# Altium schematic sheet 07_Ethernet_Interface.SchDoc
size A4; SheetNumber: 4; SheetTotal: 7
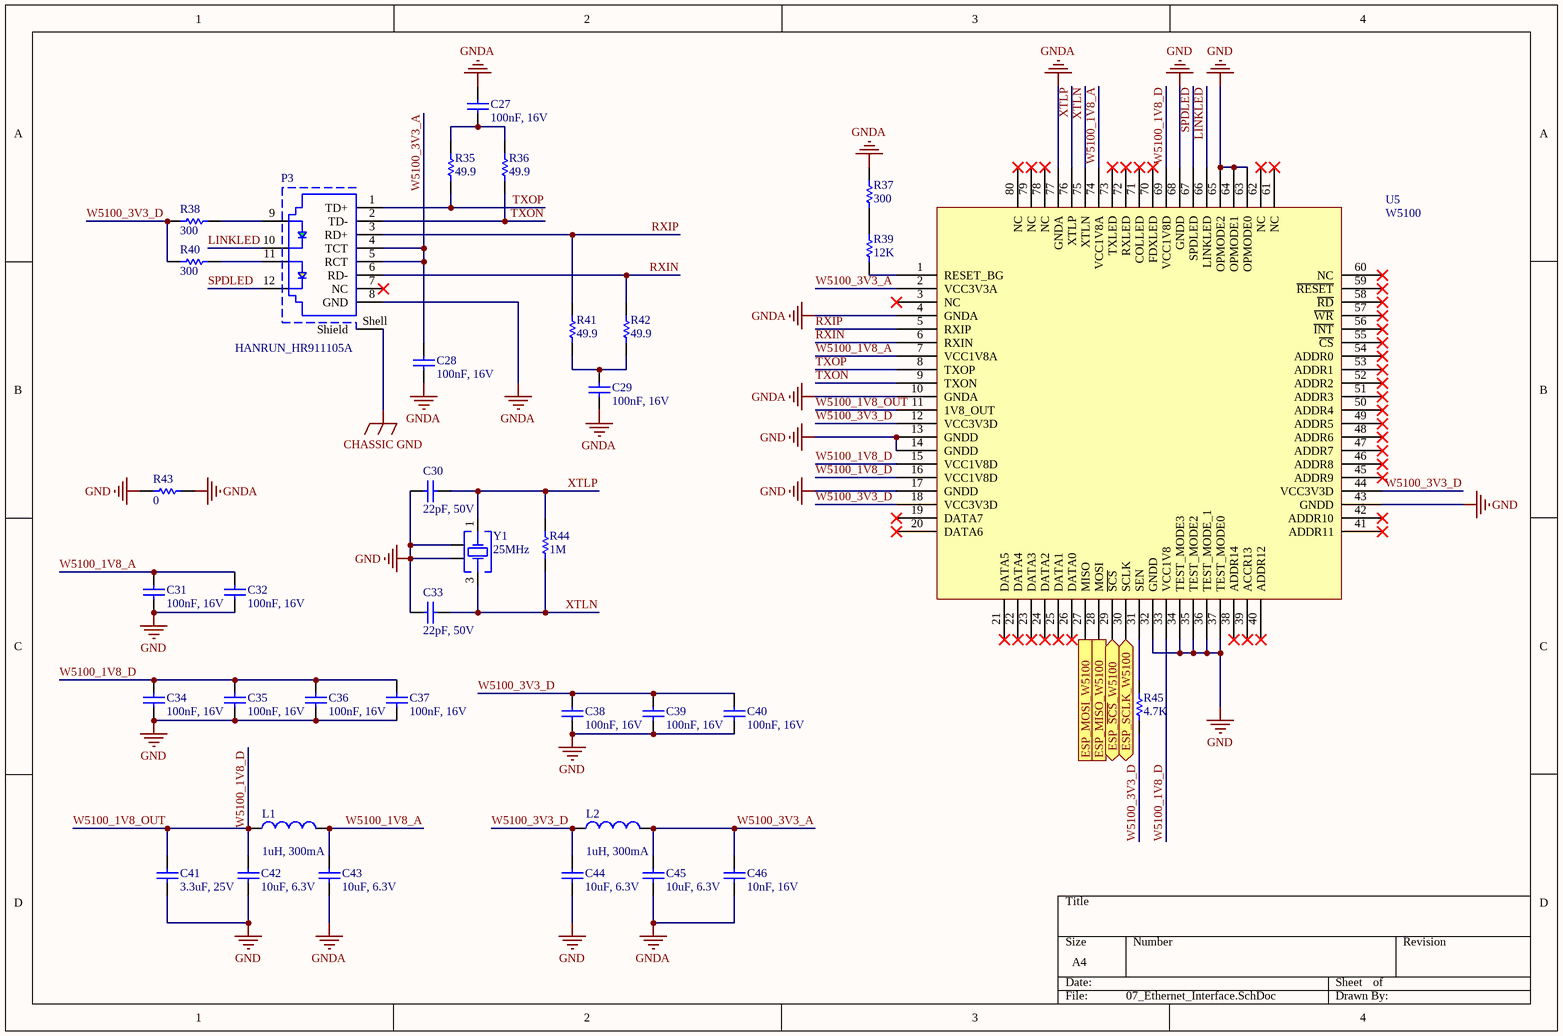
[diagram p0: 07_Ethernet_Interface.SchDoc]

## Parts
C27  100nF, 16V  [WCAP-CSGP_0603_H=0.8mm_Reflow]
C28  100nF, 16V  [WCAP-CSGP_0603_H=0.8mm_Reflow]
C29  100nF, 16V  [WCAP-CSGP_0603_H=0.8mm_Reflow]
C30  22pF, 50V  [WCAP-CSGP_0603_H=0.8mm_Reflow]
C31  100nF, 16V  [WCAP-CSGP_0603_H=0.8mm_Reflow]
C32  100nF, 16V  [WCAP-CSGP_0603_H=0.8mm_Reflow]
C33  22pF, 50V  [WCAP-CSGP_0603_H=0.8mm_Reflow]
C34  100nF, 16V  [WCAP-CSGP_0603_H=0.8mm_Reflow]
C35  100nF, 16V  [WCAP-CSGP_0603_H=0.8mm_Reflow]
C36  100nF, 16V  [WCAP-CSGP_0603_H=0.8mm_Reflow]
C37  100nF, 16V  [WCAP-CSGP_0603_H=0.8mm_Reflow]
C38  100nF, 16V  [WCAP-CSGP_0603_H=0.8mm_Reflow]
C39  100nF, 16V  [WCAP-CSGP_0603_H=0.8mm_Reflow]
C40  100nF, 16V  [WCAP-CSGP_0603_H=0.8mm_Reflow]
C41  3.3uF, 25V  [WCAP-CSGP_0805_H=1.25mm]
C42  10uF, 6.3V  [WCAP-CSGP_0603_H=0.8mm_Reflow]
C43  10uF, 6.3V  [WCAP-CSGP_0603_H=0.8mm_Reflow]
C44  10uF, 6.3V  [WCAP-CSGP_0603_H=0.8mm_Reflow]
C45  10uF, 6.3V  [WCAP-CSGP_0603_H=0.8mm_Reflow]
C46  10nF, 16V  [WCAP-CSGP_0603_H=0.8mm_Reflow]
L1  value 1uH, 300mA  [I0603]  (hidden comment: Inductor)
L2  value 1uH, 300mA  [I0603]  (hidden comment: Inductor)
P3  HANRUN_HR911105A  [HANRUN_HR911105A]
R35  value 49.9  [R0603]  (hidden comment: Resistor)
R36  value 49.9  [R0603]  (hidden comment: Resistor)
R37  value 300  [R0603]  (hidden comment: Resistor)
R38  value 300  [R0603]  (hidden comment: Resistor)
R39  value 12K  [R0603]  (hidden comment: Resistor)
R40  value 300  [R0603]  (hidden comment: Resistor)
R41  value 49.9  [R0603]  (hidden comment: Resistor)
R42  value 49.9  [R0603]  (hidden comment: Resistor)
R43  value 0  [R0603]  (hidden comment: Resistor)
R44  value 1M  [R0603]  (hidden comment: Resistor)
R45  value 4.7K  [R0603]  (hidden comment: Resistor)
U5  W5100  [CQFP40P1200X1200X160-80N]
Y1  25MHz  [WE-XTAL_CFPX-180]

## Ports
ESP_MISO_W5100 (out), ESP_MOSI_W5100 (in), ESP_SCLK_W5100 (bidir), ESP_~{SCS}_W5100 (bidir)

## Nets
CHASSIC GND: P3.Shell(Shield)
GND: C30.1 C31.1 C32.1 C33.1 C34.1 C35.1 C36.1 C37.1 C38.1 C39.1 C40.1 C41.1 C42.1 C44.1 R43.2 U5.13(GNDD) U5.14(GNDD) U5.17(GNDD) U5.32(GNDD) U5.34(TEST_MODE3) U5.35(TEST_MODE2) U5.36(TEST_MODE_1) U5.37(TEST_MODE0) U5.43(GNDD) U5.63(OPMODE0) U5.64(OPMODE1) U5.65(OPMODE2) U5.68(GNDD) Y1.2(GND&Lid) Y1.4(GND&Lid)
GNDA: C27.2 C28.1 C29.2 C43.1 C45.1 C46.1 P3.8(GND) R37.2 R43.1 U5.4(GNDA) U5.10(GNDA) U5.77(GNDA)
ESP_MISO_W5100: U5.28(MOSI) ; port ESP_MISO_W5100
ESP_MOSI_W5100: U5.27(MISO) ; port ESP_MOSI_W5100
ESP_~{SCS}_W5100: U5.29(~{SCS}) ; port ESP_~{SCS}_W5100
ESP_SCLK_W5100: U5.30(SCLK) ; port ESP_SCLK_W5100
LINKLED: P3.10 U5.66(LINKLED)
RXIN: P3.6(RD-) R42.1 U5.6(RXIN)
RXIP: P3.3(RD+) R41.1 U5.5(RXIP)
SPDLED: P3.12 U5.67(SPDLED)
TXON: P3.2(TD-) R36.1 U5.9(TXON)
TXOP: P3.1(TD+) R35.1 U5.8(TXOP)
W5100_1V8_A: C31.2 C32.2 C43.2 L1.2 U5.7(VCC1V8A) U5.74(VCC1V8A)
W5100_1V8_D: C34.2 C35.2 C36.2 C37.2 C41.2 C42.2 L1.1 U5.11(1V8_OUT) U5.15(VCC1V8D) U5.16(VCC1V8D) U5.33(VCC1V8) U5.69(VCC1V8D)  [also labelled W5100_1V8_OUT]
W5100_3V3_A: C28.2 C45.2 C46.2 L2.2 P3.4(TCT) P3.5(RCT) U5.2(VCC3V3A)
W5100_3V3_D: C38.2 C39.2 C40.2 C44.2 L2.1 R38.2 R40.2 R45.1 U5.12(VCC3V3D) U5.18(VCC3V3D) U5.44(VCC3V3D)
XTLN: C33.2 R44.1 U5.75(XTLN) Y1.3(Crystal)
XTLP: C30.2 R44.2 U5.76(XTLP) Y1.1(Crystal)
NetC27_1: C27.1 R35.2 R36.2
NetC29_1: C29.1 R41.2 R42.2
NetP3_9: P3.9 R38.1
NetP3_11: P3.11 R40.1
NetR37_1: R37.1 R39.2
NetR39_1: R39.1 U5.1(RESET_BG)
NetR45_2: R45.2 U5.31(SEN)

Not connected (* = marked no-connect by the designer): P3 7(NC)*; U5 3(NC)* 19(DATA7)* 20(DATA6)* 21(DATA5)* 22(DATA4)* 23(DATA3)* 24(DATA2)* 25(DATA1)* 26(DATA0)* 38(ADDR14)* 39(ACCR13)* 40(ADDR12)* 41(ADDR11)* 42(ADDR10)* 45(ADDR9)* 46(ADDR8)* 47(ADDR7)* 48(ADDR6)* 49(ADDR5)* 50(ADDR4)* 51(ADDR3)* 52(ADDR2)* 53(ADDR1)* 54(ADDR0)* 55(~{CS})* 56(~{INT})* 57(~{WR})* 58(~{RD})* 59(~{RESET})* 60(NC)* 61(NC)* 62(NC)* 70(FDXLED)* 71(COLLED)* 72(RXLED)* 73(TXLED)* 78(NC)* 79(NC)* 80(NC)*

## Library data of the parts
C27-C29 C31 C32 C34-C40 = 885012206046: WCAP-CSGP Multilayer Ceramic Chip Capacitor, General Purpose, size 0603, X7R, 100nF, 16V; Manufacturer: Wurth Elektronik; Rated Voltage: 16VDC; Isolation Resistance: >=5GOhm; Capacitance Tolerance: +/-10%; Technical Reference: X7R0603104K016DFCT10000; ComponentLink1Description: Manufacturer; ComponentLink1URL: http://www.we-online.de; ComponentLink2Description: Datasheet; ComponentLink2URL: https://www.we-online.com/catalog/datasheet/885012206046.pdf; Operating Temperature: -55 to +125degC; Packaging: Tape and Reel; Manufacturer Part Number: 885012206046; Published Date: May 2020; Ceramic Type: X7R; Dissipation Factor: =<3.5%; Height: 0.8mm; Mounting Technology: SMT; Size: 0603; Capacitance: 100nF
C30 C33 = 885012006053: WCAP-CSGP Multilayer Ceramic Chip Capacitor, General Purpose, size 0603, NP0, 22pF, 50V; Manufacturer: Wurth Elektronik; Rated Voltage: 50VDC; Isolation Resistance: >=10GOhm; Capacitance Tolerance: +/-5%; Dissipation Factor: Q>=400+20C; Technical Reference: NP00603220J050DFCT10000; ComponentLink1Description: Manufacturer; ComponentLink1URL: http://www.we-online.de; ComponentLink2Description: Datasheet; ComponentLink2URL: https://www.we-online.com/catalog/datasheet/885012006053.pdf; Operating Temperature: -55 to +125degC; Packaging: Tape and Reel; Manufacturer Part Number: 885012006053; Published Date: May 2020; Ceramic Type: NP0; Height: 0.8mm; Mounting Technology: SMT; Size: 0603; Capacitance: 22pF
C41 = 885012107017: WCAP-CSGP Multilayer Ceramic Chip Capacitor, General Purpose, size 0805, X5R, 3.3uF, 25V; Manufacturer: Wurth Elektronik; Rated Voltage: 25VDC; Isolation Resistance: >=0.03GOhm; Capacitance Tolerance: +/-20%; Technical Reference: X5R0805335M025DFCT10000; ComponentLink1Description: Manufacturer; ComponentLink1URL: http://www.we-online.de; ComponentLink2Description: Datasheet; ComponentLink2URL: https://www.we-online.com/catalog/datasheet/885012107017.pdf; Operating Temperature: -55 to +85degC; Packaging: Tape and Reel; Manufacturer Part Number: 885012107017; Published Date: May 2020; Ceramic Type: X5R; Dissipation Factor: =<10%; Height: 1.25mm; Mounting Technology: SMT; Size: 0805; Capacitance: 3.3uF
C42-C45 = 885012106006: WCAP-CSGP Multilayer Ceramic Chip Capacitor, General Purpose, size 0603, X5R, 10uF, 6.3V; Manufacturer: Wurth Elektronik; Rated Voltage: 6.3VDC; Isolation Resistance: >=0.01GOhm; Capacitance Tolerance: +/-20%; Technical Reference: X5R0603106M6R3DFCT10000; ComponentLink1Description: Manufacturer; ComponentLink1URL: http://www.we-online.de; ComponentLink2Description: Datasheet; ComponentLink2URL: https://www.we-online.com/catalog/datasheet/885012106006.pdf; Operating Temperature: -55 to +85degC; Packaging: Tape and Reel; Manufacturer Part Number: 885012106006; Published Date: May 2020; Ceramic Type: X5R; Dissipation Factor: =<10%; Height: 0.8mm; Mounting Technology: SMT; Size: 0603; Capacitance: 10uF
C46 = 885012206040: WCAP-CSGP Multilayer Ceramic Chip Capacitor, General Purpose, size 0603, X7R, 10nF, 16V; Manufacturer: Wurth Elektronik; Rated Voltage: 16VDC; Isolation Resistance: >=10GOhm; Capacitance Tolerance: +/-10%; Technical Reference: X7R0603103K016DFCT10000; ComponentLink1Description: Manufacturer; ComponentLink1URL: http://www.we-online.de; ComponentLink2Description: Datasheet; ComponentLink2URL: https://www.we-online.com/catalog/datasheet/885012206040.pdf; Operating Temperature: -55 to +125degC; Packaging: Tape and Reel; Manufacturer Part Number: 885012206040; Published Date: May 2020; Ceramic Type: X7R; Dissipation Factor: =<3.5%; Height: 0.8mm; Mounting Technology: SMT; Size: 0603; Capacitance: 10nF
Y1 = 830108340809: WE-XTAL Quartz Crystal, SMT, CFPX-180, 25MHz, +/-20ppm; Manufacturer: Wurth Elektronik; Frequency Stability: +/-30ppm; Load Capacitance: 12pF; ComponentLink1Description: Manufacturer; ComponentLink1URL: http://www.we-online.de; ComponentLink2Description: Datasheet; ComponentLink2URL: https://www.we-online.com/catalog/datasheet/830108340809.pdf; Operating Temperature: -40 to +105degC; Packaging: Tape and Reel; Manufacturer Part Number: 830108340809; Published Date: November 2020; Size: CFPX-180; Frequency: 25MHz; Frequency Tolerance: +/-20ppm; Mounting Technology: SMT